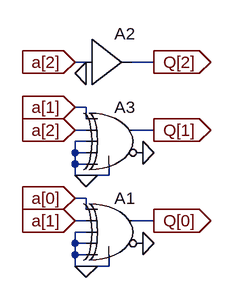
[diagram p0: schematic bin2gray_3bit.asc]
bin2gray_3bit.asc, the LTspice schematic file:
Version 4
SHEET 1 880 680
WIRE 144 0 128 0
WIRE 240 0 208 0
WIRE 144 64 128 64
WIRE 144 80 144 64
WIRE 144 96 128 96
WIRE 240 96 208 96
WIRE 144 112 128 112
WIRE 128 128 128 112
WIRE 144 128 128 128
WIRE 128 144 128 128
WIRE 144 144 128 144
WIRE 128 160 128 144
WIRE 144 160 128 160
WIRE 176 160 176 144
WIRE 176 160 144 160
WIRE 144 192 128 192
WIRE 144 208 144 192
WIRE 144 224 128 224
WIRE 240 224 208 224
WIRE 144 240 128 240
WIRE 128 256 128 240
WIRE 144 256 128 256
WIRE 128 272 128 256
WIRE 144 272 128 272
WIRE 128 288 128 272
WIRE 144 288 128 288
WIRE 176 288 176 272
WIRE 176 288 144 288
FLAG 144 288 0
FLAG 144 16 0
FLAG 224 256 0
FLAG 128 64 a[1]
IOPIN 128 64 In
FLAG 128 224 a[1]
IOPIN 128 224 In
FLAG 128 192 a[0]
IOPIN 128 192 In
FLAG 240 224 Q[0]
IOPIN 240 224 Out
FLAG 240 96 Q[1]
IOPIN 240 96 Out
FLAG 144 160 0
FLAG 128 96 a[2]
IOPIN 128 96 In
FLAG 128 0 a[2]
IOPIN 128 0 In
FLAG 224 128 0
FLAG 240 0 Q[2]
IOPIN 240 0 Out
SYMBOL Digital\\xor 192 176 R0
SYMATTR InstName A1
SYMBOL Digital\\buf1 144 -64 R0
SYMATTR InstName A2
SYMBOL Digital\\xor 192 48 R0
SYMATTR InstName A3

The netlist it stands for:
* bin2gray_3bit.asc
A1 a[0] a[1] 0 0 0 0 Q[0] 0 XOR
A2 a[2] 0 0 0 0 0 Q[2] 0 BUF
A3 a[1] a[2] 0 0 0 0 Q[1] 0 XOR
.backanno
.end